# Altium schematic sheet AU0001A.SchDoc
size B; Organization: Altium Limited; Address1: 3 Minna Close; Address2: Belrose; Address3: NSW 2085; Address4: Australia; SheetNumber: 1; SheetTotal: 1; PROJECT_ENGINEER: E. Hughes; SCH_DATE: 2017-11-01; PAGE_TITLE: -
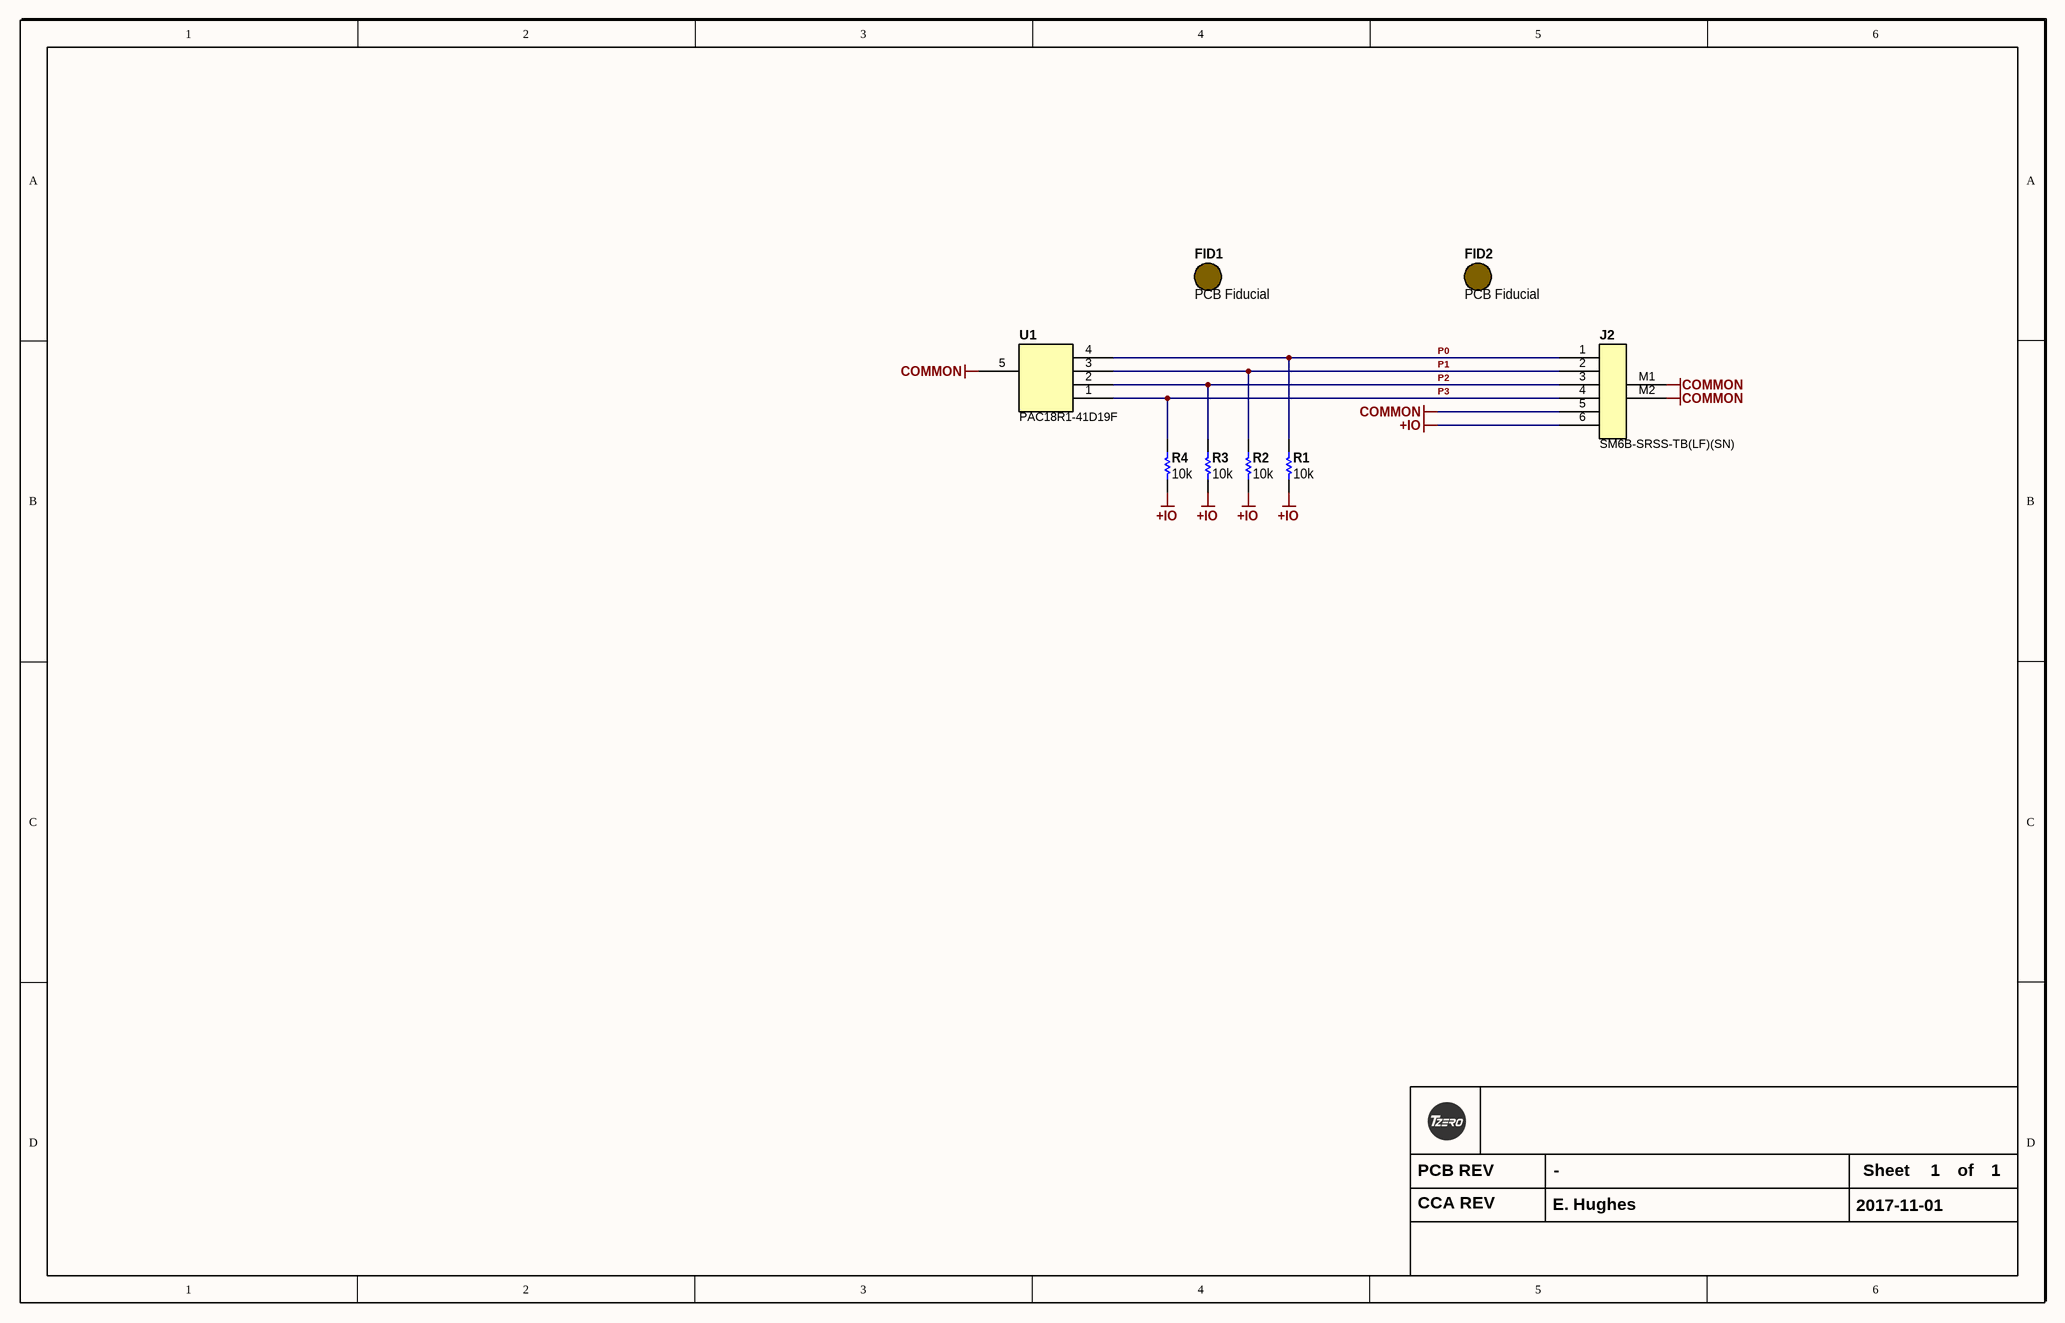
[diagram p0: AU0001A.SchDoc]

## Parts
FID1  PCB Fiducial  [Fiducial 1mm - 2mm]  (no BOM)
FID2  PCB Fiducial  [Fiducial 1mm - 2mm]  (no BOM)
J2  SM6B-SRSS-TB(LF)(SN)  [SM06B-SRSS-TB(LF)(SN)]
R1  10k  [R0603_0.55MM_MD]
R2  10k  [R0603_0.55MM_MD]
R3  10k  [R0603_0.55MM_MD]
R4  10k  [R0603_0.55MM_MD]
U1  PAC18R1-41D19F  [PAC18R1]

## Nets
+IO: J2.6 R1.1 R2.1 R3.1 R4.1
COMMON: J2.5 J2.M1 J2.M2 U1.5
P0: J2.1 R1.2 U1.4
P1: J2.2 R2.2 U1.3
P2: J2.3 R3.2 U1.2
P3: J2.4 R4.2 U1.1

## Notes on the sheet
- PCB REV
- Sheet
- of
- CCA REV

## Library data of the parts
FID1 FID2 = Fiducial: Value: PCB Fiducial
J2 = SM06B-SRSS-TB(LF)(SN): 6 Positions Header, Shrouded Connector 0.039" (1.00mm) Surface Mount, Right Angle Tin; Manufacturer: JST; Number of Positions: 6; Connector Type: Male Pin; Contact Resistance: 40mR; Pitch: 1mm; Current Rating: 1A; Voltage Rating (AC): 50V; Insulation Resistance: 100MR; Gender: Male; Value: SM6B-SRSS-TB(LF)(SN); Supplier 1: Digi-Key; Manufacturer Part Number: SM06B-SRSS-TB(LF)(SN); Stock 1: 40560; Pricing 1: 1=0.83, 10=0.782, 100=0.5996, 500=0.5214, 1000=0.4301 (USD); Mount: Surface Mount; Contact Material: Copper,Copper Alloy; Contact Plating: Copper,Tin,Lead; Colour: Natural; Housing Colour: Beige; Housing Material: Polyamide; Min Operating Temperature: -25°C; Max Operating Temperature: 85°C; Number of Rows: 1; Termination: Solder; Packaging: Tape and Reel; Orientation: Right Angle; Number of Contacts: 6; Lead Free: Lead Free; ComponentLink1URL: https://datasheet.ciiva.com/11752/0900766b8082f544-11752176.pdf; ComponentLink1Description: https://datasheet.ciiva.com/11752/0900766b8082f544-11752176.pdf; ComponentLink2URL: https://datasheet.ciiva.com/16217/sm06b-srss-tblfsn-16217552.pdf; ComponentLink2Description: https://datasheet.ciiva.com/16217/sm06b-srss-tblfsn-16217552.pdf; ComponentLink3URL: https://datasheet.ciiva.com/26894/getdatasheetpartid-490708-26894951.pdf; ComponentLink3Description: https://datasheet.ciiva.com/26894/getdatasheetpartid-490708-26894951.pdf; Supplier Part Number 1: 455-1806-1-ND; Material: Polyamide; Voltage Rating: 50V; Lead Pitch: 1mm; REACH SVHC: No SVHC; Flammability Rating: UL94 V-0; ComponentLink4URL: https://datasheet.ciiva.com/26894/getdatasheetpartid-639890-26894680.pdf; ComponentLink4Description: https://datasheet.ciiva.com/26894/getdatasheetpartid-639890-26894680.pdf; ComponentLink5URL: https://datasheet.ciiva.com/8052/91630-8052281.pdf; ComponentLink5Description: https://datasheet.ciiva.com/8052/91630-8052281.pdf; ComponentLink6URL: https://datasheet.ciiva.com/712/esr-712571.pdf; ComponentLink6Description: https://datasheet.ciiva.com/712/esr-712571.pdf; Max Current Rating: 1A; Max Voltage Rating (AC): 50V; Max Voltage Rating (DC): 50V; Length: 8mm; Depth: 4.95mm; ComponentLink7URL: https://datasheet.ciiva.com/712/esr-712572.pdf; ComponentLink7Description: https://datasheet.ciiva.com/712/esr-712572.pdf; ComponentLink8URL: https://datasheet.ciiva.com/730/esr-730671.pdf; ComponentLink8Description: https://datasheet.ciiva.com/730/esr-730671.pdf
R1-R4 = ERJ-3EKF1002V: RES 10K OHM 1/10W 1% 0603 SMD; Manufacturer: Panasonic Electronic Components; Package Power: 0603  (0.1W); Power (Watts): 0.1W- 1/10W; Temperature Coefficient: ±100ppm/°C; Limiting Element Voltage: 75; Maximum Overload Voltage: 150; Maximum Working Voltage: 31.6V; Substitution Notes: 10k , ±1% , 0603 , AEC-Q200; Value: 10k; Manufacturer Part Number: ERJ-3EKF1002V; ComponentLink1Description: Internal Datasheet; ComponentLink1URL: datasheets\Panasonic Electronic Components\AOA0000CE2.pdf; ComponentLink2Description: External Datasheet; ComponentLink2URL: http://industrial.panasonic.com/www-data/pdf/AOA0000/AOA0000CE2.pdf; Supplier 1: Digi-Key; Supplier Part Number 1: P10.0KHCT-ND; Category: Resistors; Resistance (Ohms): 10k; Composition: Thick Film; Features: -; Tolerance: ±1%; Package: 0603 (1608 Metric); Supplier Package: 0603; Size / Dimension: 0.063" L x 0.031" W (1.60mm x 0.80mm); Height: 0.55MM; Number of Terminations: 2; Packaging: Cut Tape (CT); Sort Value: 10000; Sort Value Package: 603_10000; Ratings: AEC-Q200
U1 = PAC18R1-41D19F: Manufacturer: Bourns; Supplier 1: Mouser; Supplier Part Number 1: 652-PAC18R1-41D19F; Manufacturer Part Number: PAC18R1-41D19F; RoHS: No; Stock 1: 1877; Pricing: 1=3.26000, 10=3.04000, 50=2.60000, 100=2.45000, 1000=2.00000, 10000=1.91000 (USD); Value: PAC18R1-41D19F